# Altium schematic sheet KP_Fedorov_SM5-71B.SchDoc
size 594 x 420 mm; ApprovedBy: Глазков; CheckedBy: Глазков; Address1: Address1; Address2: Address2; Address3: Address3; Address4: Address4; DocumentNumber: АБВГ.123456.001 Э3; SheetTotal: 1; DocumentType: Схема электрическая принципиальная; FirstReferrence: АБВГ.123456.001; DevelopedBy: Сафронов
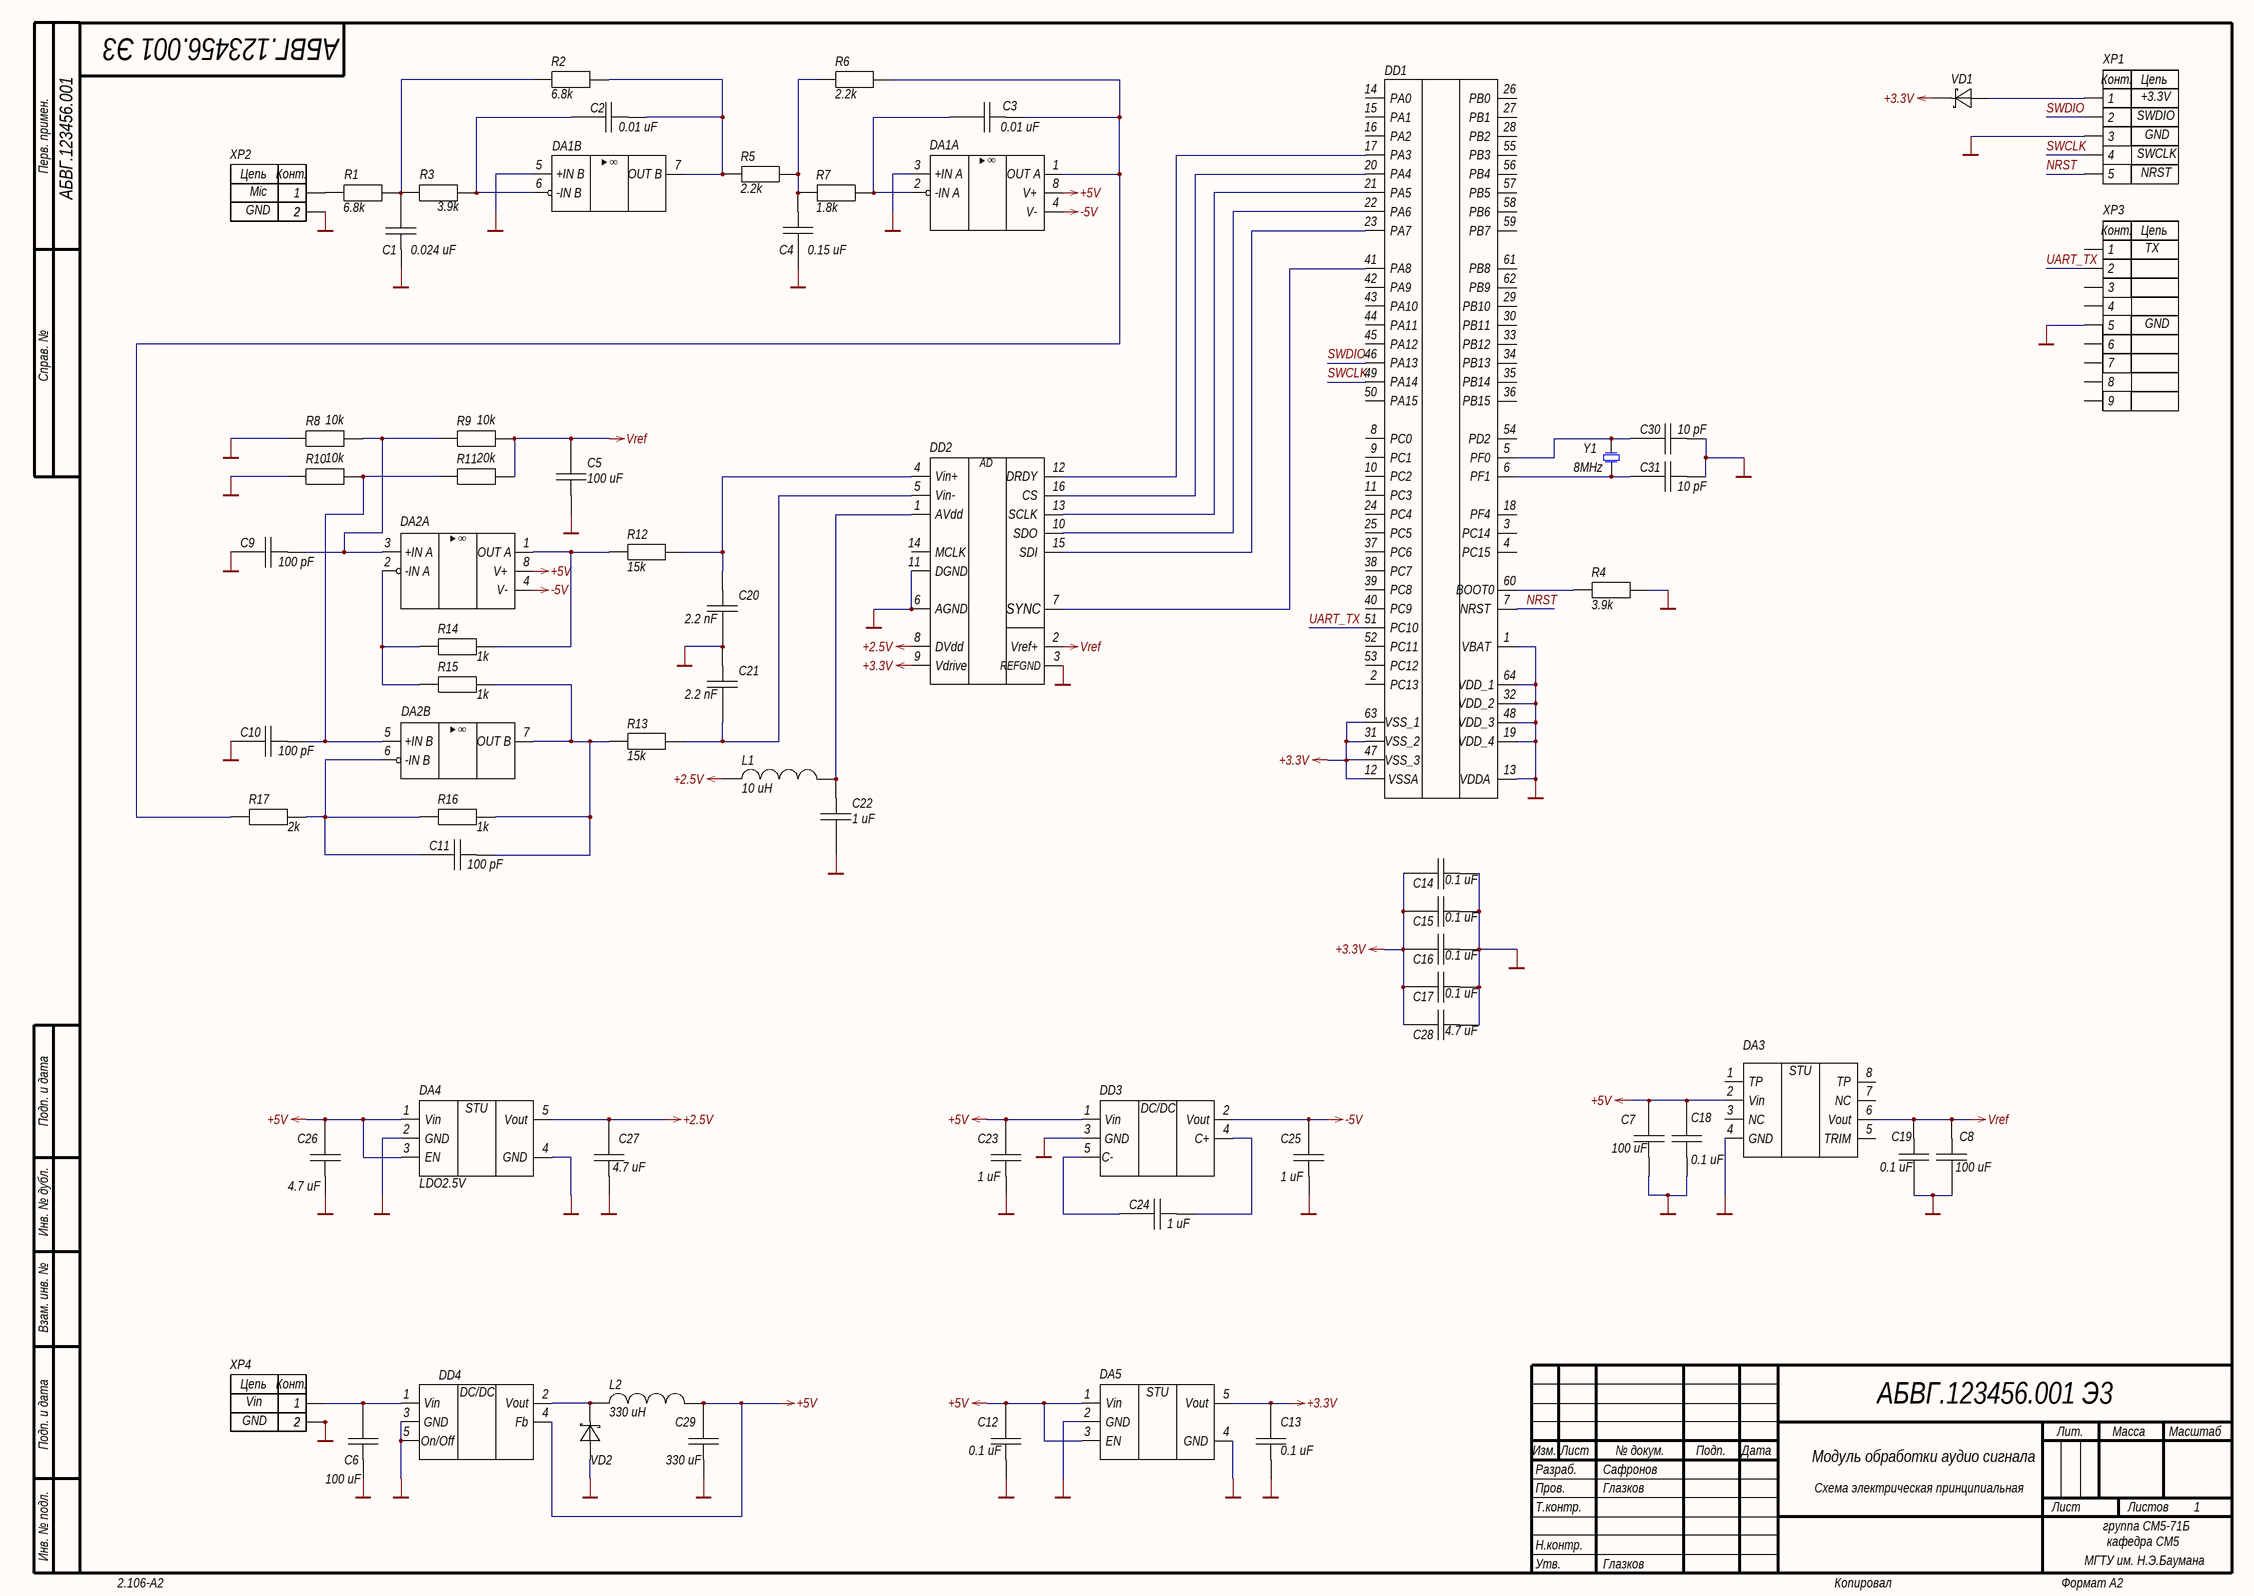
[diagram p0: KP_Fedorov_SM5-71B.SchDoc]

## Parts
C1  0.024 uF  [0805 Capicator]
C2  0.01 uF  [0805 Capicator]
C3  0.01 uF  [0805 Capicator]
C4  0.15 uF  [0805 Capicator]
C5  100 uF  [0805 Capicator]
C6  100 uF  [0805 Capicator]
C7  100 uF  [0805 Capicator]
C8  100 uF  [0805 Capicator]
C9  100 pF  [0805 Capicator]
C10  100 pF  [0805 Capicator]
C11  100 pF  [0805 Capicator]
C12  0.1 uF  [0805 Capicator]
C13  0.1 uF  [0805 Capicator]
C14  0.1 uF  [0805 Capicator]
C15  0.1 uF  [0805 Capicator]
C16  0.1 uF  [0805 Capicator]
C17  0.1 uF  [0805 Capicator]
C18  0.1 uF  [0805 Capicator]
C19  0.1 uF  [0805 Capicator]
C20  2.2 nF  [0805 Capicator]
C21  2.2 nF  [0805 Capicator]
C22  1 uF  [0805 Capicator]
C23  1 uF  [0805 Capicator]
C24  1 uF  [0805 Capicator]
C25  1 uF  [0805 Capicator]
C26  4.7 uF  [0805 Capicator]
C27  4.7 uF  [0805 Capicator]
C28  4.7 uF  [0805 Capicator]
C29  330 uF  [0805 Capicator]
C30  10 pF  [0805 Capicator]
C31  10 pF  [0805 Capicator]
DA1  AD8502  [SOT-23-8]  (value not drawn)  (parts A,B of 2)
DA2  AD8502  [SOT-23-8]  (value not drawn)  (parts A,B of 2)
DA3  LDO  [SOIC-8]  (value not drawn)
DA4  LDO2.5V  [SOT-23-5]
DA5  LDO3.3V  [SOT-23-5]  (value not drawn)
DD1  STM32F303RCT7  [LQFP64]  (value not drawn)
DD2  24bit 128k  [TSSOP-16]  (value not drawn)
DD3  DC/DC inv  [SOT-23-5]  (value not drawn)
DD4  DC/DC  [TO-263-5L]  (value not drawn)
L1  10 uH  [0805 Inductor]
L2  330 uH  [0805 Inductor]
R1  6.8k  [0805 Resistor]
R2  6.8k  [0805 Resistor]
R3  3.9k  [0805 Resistor]
R4  3.9k  [0805 Resistor]
R5  2.2k  [0805 Resistor]
R6  2.2k  [0805 Resistor]
R7  1.8k  [0805 Resistor]
R8  10k  [0805 Resistor]
R9  10k  [0805 Resistor]
R10  10k  [0805 Resistor]
R11  20k  [0805 Resistor]
R12  15k  [0805 Resistor]
R13  15k  [0805 Resistor]
R14  1k  [0805 Resistor]
R15  1k  [0805 Resistor]
R16  1k  [0805 Resistor]
R17  2k  [0805 Resistor]
VD1  MBR0520LT1G  [sod-123 - duplicate]  (value not drawn)
VD2  MBR0520LT1G  [sod-123 - duplicate]  (value not drawn)
XP1  PLS-5  [PBS 5x1]  (value not drawn)
XP2  PBS2  [PBS 2x1]  (value not drawn)
XP3  SCNM9FM2MBK  [DB9]  (value not drawn)
XP4  PBS2  [PBS 2x1]  (value not drawn)
Y1  8MHz  [R38]

## Nets
+2.5V: C27.1 DA4.5(Vout) DD2.8(DVdd) L1.1
+3.3V: C13.1 C14.1 C15.1 C16.1 C17.1 C28.1 DA5.5(Vout) DD1.12(VSSA) DD1.31(VSS_2) DD1.47(VSS_3) DD1.63(VSS_1) DD2.9(Vdrive) VD1.2
+5V: C7.1 C12.1 C18.1 C23.1 C26.1 C29.1 DA1.8(V+) DA2.8(V+) DA3.2(Vin) DA4.1(Vin) DA4.3(EN) DA5.1(Vin) DA5.3(EN) DD3.1(Vin) DD4.4(Fb) L2.2
-5V: C25.1 DA1.4(V-) DA2.4(V-) DD3.2(Vout)
GND: C1.2 C4.1 C5.2 C6.2 C7.2 C8.1 C9.1 C10.1 C12.2 C13.2 C14.2 C15.2 C16.2 C17.2 C18.2 C19.1 C20.1 C21.2 C22.1 C23.2 C25.2 C26.2 C27.2 C28.2 C29.2 C30.2 C31.2 DA1.3(+IN_A) DA1.5(+IN_B) DA3.4(GND) DA4.2(GND) DA4.4(GND) DA5.2(GND) DA5.4(GND) DD1.1(VBAT) DD1.13(VDDA) DD1.19(VDD_4) DD1.32(VDD_2) DD1.48(VDD_3) DD1.64(VDD_1) DD2.3(REFGND) DD2.6(AGND) DD2.11(DGND) DD3.3(GND) DD4.3(GND) DD4.5(On/Off) R4.2 R8.1 R10.1 VD2.1 XP1.3 XP2.2 XP3.5 XP4.2
Vref: C5.1 C8.2 C19.2 DA3.6(Vout) DD2.2(Vref+) R9.2 R11.2
NRST: DD1.7(NRST) XP1.5
SWCLK: DD1.49(PA14) XP1.4
SWDIO: DD1.46(PA13) XP1.2
UART_TX: DD1.51(PC10) XP3.2
NetC1_1: C1.1 R1.2 R2.1 R3.1
NetC2_1: C2.1 DA1.6(-IN_B) R3.2
NetC2_2: C2.2 DA1.7(OUT_B) R2.2 R5.2
NetC3_1: C3.1 DA1.2(-IN_A) R7.1
NetC3_2: C3.2 DA1.1(OUT_A) R6.2 R17.1
NetC4_2: C4.2 R5.1 R6.1 R7.2
NetC6_1: C6.1 DD4.1(Vin) XP4.1
NetC9_2: C9.2 DA2.3(+IN_A) R8.2 R9.1
NetC10_2: C10.2 DA2.5(+IN_B) R10.2 R11.1
NetC11_1: C11.1 DA2.6(-IN_B) R16.1 R17.2
NetC11_2: C11.2 DA2.7(OUT_B) R13.1 R15.2 R16.2
NetC20_2: C20.2 DD2.4(Vin+) R12.2
NetC21_1: C21.1 DD2.5(Vin-) R13.2
NetC22_2: C22.2 DD2.1(AVdd) L1.2
NetC24_1: C24.1 DD3.5(C-)
NetC24_2: C24.2 DD3.4(C+)
NetC30_1: C30.1 DD1.5(PF0) Y1.1
NetC31_1: C31.1 DD1.6(PF1) Y1.2
NetDA2_1: DA2.1(OUT_A) R12.1 R14.2
NetDA2_2: DA2.2(-IN_A) R14.1 R15.1
NetDD1_17: DD1.17(PA3) DD2.12(DRDY)
NetDD1_20: DD1.20(PA4) DD2.16(CS)
NetDD1_21: DD1.21(PA5) DD2.13(SCLK)
NetDD1_22: DD1.22(PA6) DD2.10(SDO)
NetDD1_23: DD1.23(PA7) DD2.15(SDI)
NetDD1_41: DD1.41(PA8) DD2.7(SYNC)
NetDD1_60: DD1.60(BOOT0) R4.1
NetDD4_2: DD4.2(Vout) L2.1 VD2.2
NetR1_1: R1.1 XP2.1
NetVD1_1: VD1.1 XP1.1

Not connected (* = marked no-connect by the designer): DA3 1(TP) 3(NC) 5(TRIM) 7(NC) 8(TP); DD1 2(PC13) 3(PC14) 4(PC15) 8(PC0) 9(PC1) 10(PC2) 11(PC3) 14(PA0) 15(PA1) 16(PA2) 18(PF4) 24(PC4) 25(PC5) 26(PB0) 27(PB1) 28(PB2) 29(PB10) 30(PB11) 33(PB12) 34(PB13) 35(PB14) 36(PB15) 37(PC6) 38(PC7) 39(PC8) 40(PC9) 42(PA9) 43(PA10) 44(PA11) 45(PA12) 50(PA15) 52(PC11) 53(PC12) 54(PD2) 55(PB3) 56(PB4) 57(PB5) 58(PB6) 59(PB7) 61(PB8) 62(PB9); DD2 14(MCLK); XP3 1 3 4 6 7 8 9

## Notes on the sheet
- (near XP1) SWDIO
- (near XP1) +3.3V
- (near XP1) SWCLK
- GND
- (near XP2) Mic
- (near XP1) NRST
- TX
- Vin
- Модуль обработки аудио сигнала
- группа СМ5-71Б
- кафедра СМ5
- МГТУ им. Н.Э.Баумана
- Перв. примен.
- Справ. №
- Подп. и дата
- Инв. № дубл.
- Взам. инв. №
- Разраб.
- Изм.
- Лист
- № докум.
- Подп.
- Дата
- Лит.
- Масса
- Масштаб
- Пров.
- Т.контр.
- Листов
- Инв. № подл.
- Утв.
- Н.контр.
- 2.106-A2
- Копировал
- Формат А2
- (in symbol ADC) AD
- (in symbol Conn2x1) Цепь; Конт.
- (in symbol Conn5x1) Конт.; Цепь
- (in symbol Conn9x1) Конт.; Цепь
- (in symbol DC/DC inv) DC/DC
- (in symbol LDO) STU
- (in symbol LDO2.5V) STU
- (in symbol LDO3.3V) STU
- (in symbol OpAmp, part A) ▶; ∞
- (in symbol OpAmp, part B) ▶; ∞

## Library data of the parts
C1 = Capacitor: Value: 24n; ValueType: Конденсатор; Tolerance: *; Dielectric: *; Voltage: *; ESR: *; URL: *; Temp: *; Power: *; Case: *; ValueManufacturer: *; ValueManufacturerPartNumber: *; ValueDescription: *
C2 C3 = Capacitor: Value: 10n; ValueType: Конденсатор; Tolerance: *; Dielectric: *; Voltage: *; ESR: *; URL: *; Temp: *; Power: *; Case: *; ValueManufacturer: *; ValueManufacturerPartNumber: *; ValueDescription: *
C4 = Capacitor: Value: 150n; ValueType: Конденсатор; Tolerance: *; Dielectric: *; Voltage: *; ESR: *; URL: *; Temp: *; Power: *; Case: *; ValueManufacturer: *; ValueManufacturerPartNumber: *; ValueDescription: *
C5-C31 = Capacitor: ValueType: Конденсатор; Value: *; Tolerance: *; Dielectric: *; Voltage: *; ESR: *; URL: *; Temp: *; Power: *; Case: *; ValueManufacturer: *; ValueManufacturerPartNumber: *; ValueDescription: *
DA1 DA2 = OpAmp: ref: chipdip.ru/product/ad8502arjz-reel7
DA3 = LDO: ADR445BRZ
DA4 = LDO2.5V: ADM7160AUJZ
DA5 = LDO3.3V: TPS78233DDCR
DD1 = STM32F303RCT7: ARM Cortex-M4 32-bit MCU, 256 KB Flash, 40 KB Internal RAM, 52 I/Os, 64-pin LQFP, -40 to 105 degC, Tray, 39x12bit ADC; Manufacturer: STMicroelectronics; ComponentLink2Description: Datasheet; ComponentLink2URL: http://www.st.com/st-web-ui/static/active/en/resource/technical/document/datasheet/DM00058181.pdf; ComponentLink3Description: ChipDip; ComponentLink3URL: https://www.chipdip.ru/product1/8001934304?from=suggest_product; Part Number: STM32F303RCT7; Type: IC
DD2 = ADC: AD7767
DD3 = DC/DC inv: TPS60403DBVR
DD4 = DC/DC: LM2575S-5.0/NOPB
L1 L2 = Inductor: ValueType: Индуктивность; Case: *; ESR: *; Temp: *; Tolerance: *; URL: *; Value: *; ValueDescription: *; ValueManufacturer: *; ValueManufacturerPartNumber: *
R1-R17 = Resistor: ValueType: Резистор; Tolerance: *; URL: *; Temp: *; Power: *; Case: *; ValueManufacturer: *; ValueManufacturerPartNumber: *; ValueDescription: *
  R1 R2: Value: 6.8k
  R3: Value: 3.9k
  R4 R8-R17: Value: *
  R5 R6: Value: 2.2k
  R7: Value: 1.8k
VD1 VD2 = Diode Schottky: link: https://www.chipdip.ru/product/mbr0520lt1
XP1 = Conn5x1: Manufacturer: Amass; ComponentLink1URL: chipdip.ru/product/pls-5; Part Number: PLS-5; Type: Connector
XP2 XP4 = Conn2x1: Type: Connector
XP3 = Conn9x1: DB-9M; Part Number: XT30PW; Manufacturer: Amass; ComponentLink1Description: AliExpress; ComponentLink1URL: https://www.chipdip.ru/product/scnm9fm2mbk; Type: Connector
Y1 = Crystal 8MHz: Crystal. HC-49S (US); Manufacturer: China; Part Number: 8.000MHzHC-49US; Type: Crystal; ComponentLink1Description: Chip&Dip; ComponentLink1URL: https://www.chipdip.ru/product/8mhz-hc-49s